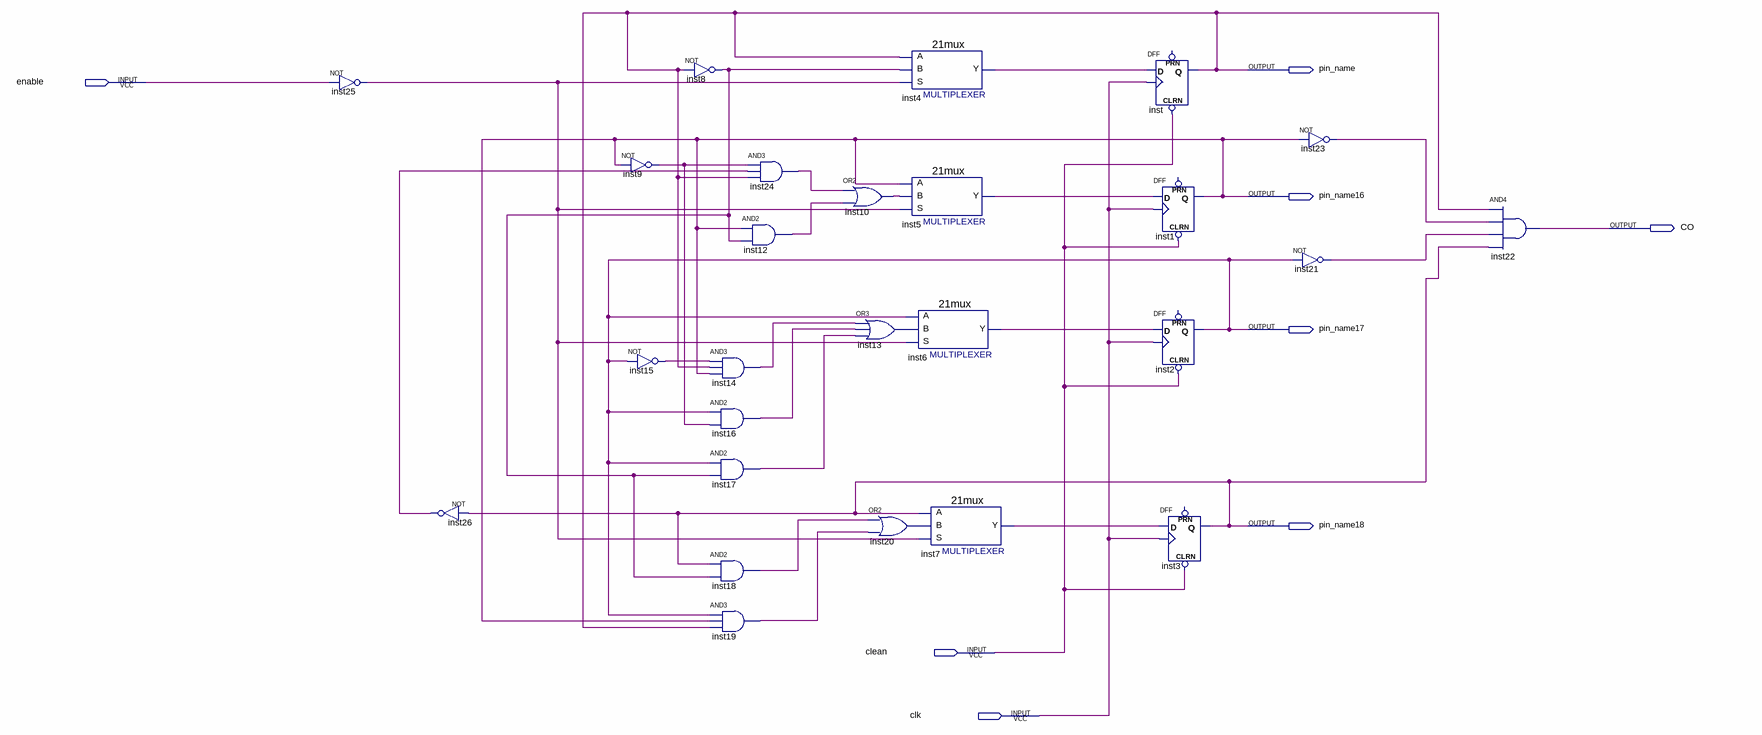
[diagram p0: schematic sheet]
// Quartus schematic bcd.bdf as structural Verilog: 26 symbols, 8 pins
module bcd (
  input  enable,
  input  clean,
  input  clk,
  output pin_name,
  output pin_name16,
  output CO,
  output pin_name17,
  output pin_name18
);

  wire inst4_y, inst5_y, inst6_y, inst7_y, inst8_out, inst9_out, inst10_out, inst12_out, inst13_out,
       inst14_out, inst15_out, inst16_out, inst17_out, inst18_out, inst19_out, inst20_out, inst21_out,
       inst23_out, inst24_out, inst25_out, inst26_out;

  not inst25 (inst25_out, enable);
  not inst26 (inst26_out, pin_name18);
  not inst9 (inst9_out, pin_name16);
  not inst15 (inst15_out, pin_name17);
  not inst8 (inst8_out, pin_name);
  and inst14 (inst14_out, inst15_out, pin_name, pin_name16);
  and inst16 (inst16_out, pin_name17, inst9_out);
  and inst17 (inst17_out, pin_name17, inst8_out);
  and inst18 (inst18_out, pin_name18, inst8_out);
  and inst19 (inst19_out, pin_name17, pin_name16, pin_name);
  and inst24 (inst24_out, inst9_out, inst26_out, pin_name);
  and inst12 (inst12_out, pin_name16, inst8_out);
  or inst10 (inst10_out, inst24_out, inst12_out);
  or inst13 (inst13_out, inst14_out, inst16_out, inst17_out);
  or inst20 (inst20_out, inst18_out, inst19_out);
  \21mux  inst4 (.S(inst25_out), .B(inst8_out), .A(pin_name), .Y(inst4_y));
  \21mux  inst5 (.S(inst25_out), .B(inst10_out), .A(pin_name16), .Y(inst5_y));
  \21mux  inst6 (.S(inst25_out), .B(inst13_out), .A(pin_name17), .Y(inst6_y));
  \21mux  inst7 (.S(inst25_out), .B(inst20_out), .A(pin_name18), .Y(inst7_y));
  DFF inst (.CLRN(clean), .CLK(clk), .D(inst4_y), .Q(pin_name));  // open: PRN
  DFF inst1 (.CLRN(clean), .CLK(clk), .D(inst5_y), .Q(pin_name16));  // open: PRN
  DFF inst2 (.CLRN(clean), .CLK(clk), .D(inst6_y), .Q(pin_name17));  // open: PRN
  DFF inst3 (.CLRN(clean), .CLK(clk), .D(inst7_y), .Q(pin_name18));  // open: PRN
  not inst21 (inst21_out, pin_name17);
  not inst23 (inst23_out, pin_name16);
  and inst22 (CO, pin_name, inst23_out, inst21_out, pin_name18);
endmodule
